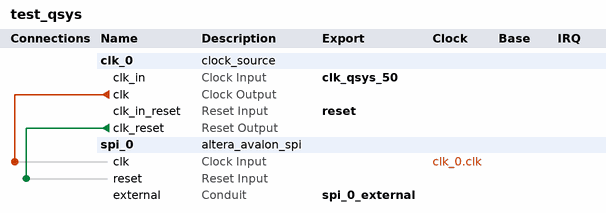
[diagram p0: system contents]
# Platform Designer (Qsys) system test_qsys, Cyclone II EP2C70F896C6
# Parameters at their usual value, and those the tool derives, are not listed.
package require -exact qsys 13.0
create_system test_qsys
set_project_property DEVICE_FAMILY {Cyclone II}
set_project_property DEVICE EP2C70F896C6

add_instance clk_0 clock_source 13.0
set_instance_parameter_value clk_0 clockFrequency 20000000
set_instance_parameter_value clk_0 resetSynchronousEdges BOTH

add_instance spi_0 altera_avalon_spi 13.0.1.99.2
set_instance_parameter_value spi_0 clockPolarity 0
set_instance_parameter_value spi_0 dataWidth 16
set_instance_parameter_value spi_0 masterSPI true
set_instance_parameter_value spi_0 numberOfSlaves 1
set_instance_parameter_value spi_0 targetClockRate 20000000

# connections
add_connection clk_0.clk spi_0.clk clock
add_connection clk_0.clk_reset spi_0.reset reset

# exported interfaces
add_interface clk_qsys_50 clock sink
set_interface_property clk_qsys_50 EXPORT_OF clk_0.clk_in
add_interface reset reset sink
set_interface_property reset EXPORT_OF clk_0.clk_in_reset
add_interface spi_0_external conduit end
set_interface_property spi_0_external EXPORT_OF spi_0.external

set_interconnect_requirement {$system} qsys_mm.clockCrossingAdapter HANDSHAKE
set_interconnect_requirement {$system} qsys_mm.maxAdditionalLatency 1

save_system test_qsys.qsys
